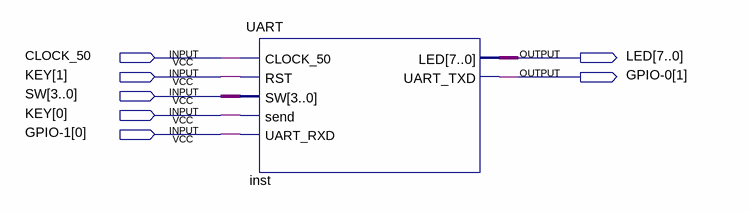
[diagram p0: schematic sheet]
// Quartus schematic ALL.bdf as structural Verilog: 1 symbols, 7 pins
module ALL (
  input  CLOCK_50,
  input  [1:0] KEY,
  input  [3:0] SW,
  input  [0:0] \GPIO-1 ,
  output [7:0] LED,
  output [1:1] \GPIO-0 
);

  UART inst (
    .CLOCK_50(CLOCK_50), .RST(KEY[1]), .SW(SW), .send(KEY[0]), .UART_RXD(\GPIO-1 [0]), .LED(LED),
    .UART_TXD(\GPIO-0 [1]));
endmodule
